# EAGLE design TDA2003-Amplifier-2 (EAGLE 7.2.0)
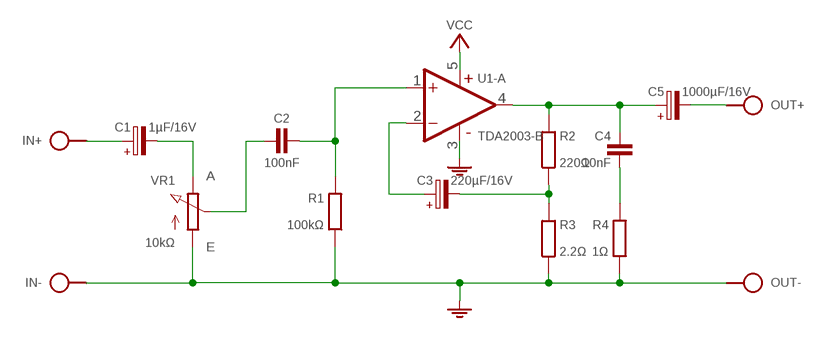
[diagram p0: schematic, sheet 1]

## Parts
C1  1µF/16V  CPOL-HE2,5-4  [E2,5-4]
C2  100nF  C-H050-020X044/V  [C050-020X044/V]
C3  220µF/16V  CPOL-HE5-5  [E5-5]
C4  10nF  C050-025X075/V  [C050-025X075/V]
C5  1000µF/16V  CPOL-HE5-5  [E5-5]
IN  SPAD+--+  [SPAD-+]
OUT  SPAD+-+-  [SPAD+-]
PWR  VCC_GNDL  [SPAD-+]
R1  100kΩ  R0204/10-V  [0204/10-V]
R2  220Ω  R0204/10-V  [0204/10-V]
R3  2.2Ω  R0204/10-V  [0204/10-V]
R4  1Ω  R0204/10-V  [0204/10-V]
U1  TDA2003-B  [TO220-B5]
VR1  10kΩ  POT-3P  [CONN-3P]

## Nets
AOUT: C4.1 C5.+ R2.1 U1.4(-A:OUT)
FB: C3.- R2.2 R3.1
GND: IN.1 OUT.1 PWR.1 R1.2 R3.2 R4.2 U1.3(-B:V-) VR1.1(A)
IN+: C2.2 R1.1 U1.1(-A:+IN)
IN-: C3.+ U1.2(-A:-IN)
N$1: C4.2 R4.1
N$2: C2.1 VR1.2(S)
N$3: C1.- VR1.3(E)
N$7: C1.+ IN.2
OUT: C5.- OUT.2
VCC: PWR.2 U1.5(-B:V+)

## Library data of the parts
C1 C3 C5 = c:CPOL-H
C2 = c:C-H
C4 = c:C: CAPACITOR, European symbol
IN OUT = pad:SPAD+-
PWR = pad:VCC_GND
R1-R4 = r:R: RESISTOR, European symbol
U1 = ic:TDA2003
VR1 = r:POT

## Board
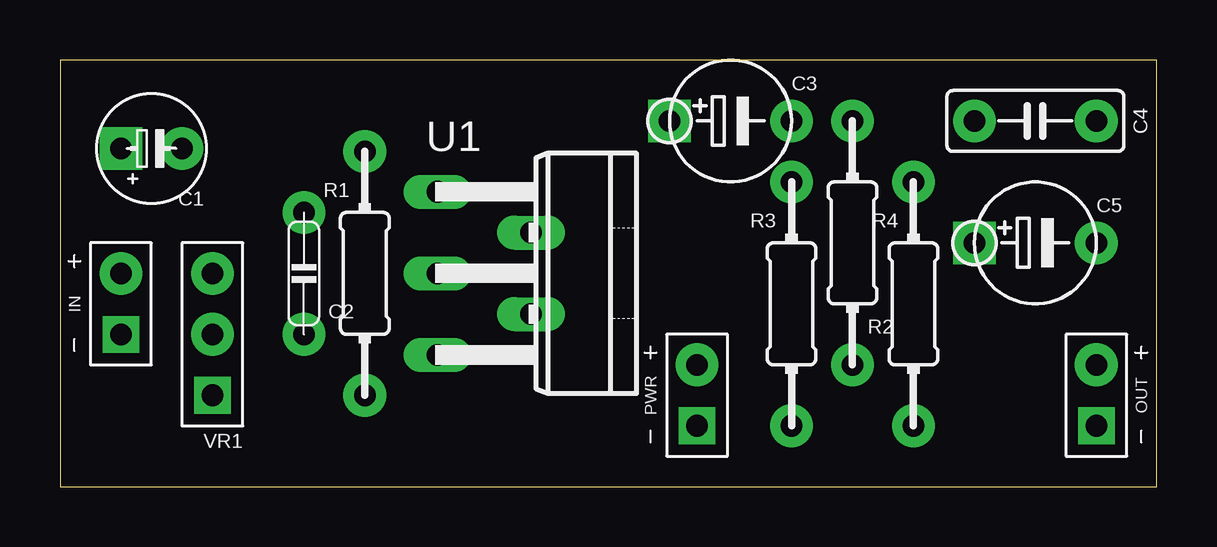
[diagram p1: board, top side]
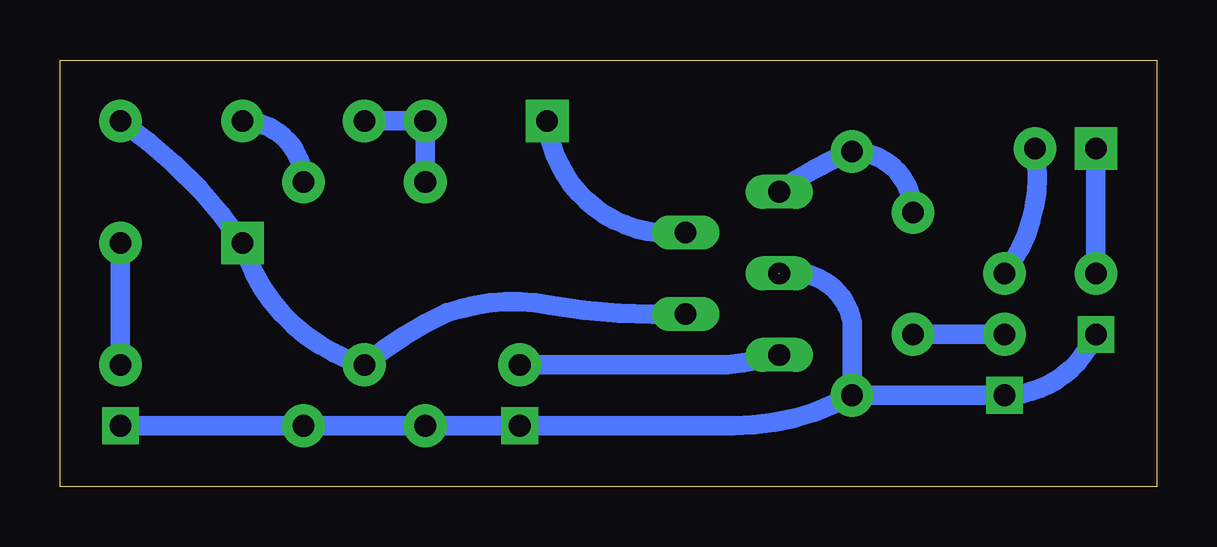
[diagram p2: board, bottom side, seen from below]

Size 45.7 x 17.78 mm. Coordinates in mm from the lower left corner, seen from the top.
Outline: 0,0 45.7,0 45.7,17.78 0,17.78 0,0
Copper layers (1*16): Top 0.035mm / dielectric 1.5mm / Bottom 0.035mm
Design rules "default": minimum track width 10mil, minimum drill 24mil, track to track 8mil, track to pad 8mil, pad to pad 8mil, via to via 8mil, smd to smd 8mil, copper to edge 40mil, drill to drill 8mil, minimum pad ring 10mil, minimum via ring 8mil, stop-mask expansion 4mil, vias tented up to drill 0mil, thermal gap 10mil

### Footprints (pad centres in the part's own frame; a part is rotated, then mirrored left to right if it is on the bottom)
E2,5-4 = drill 0.9 pad 1.778 square: + 1.27,0 | drill 0.9 pad 1.778: - -1.27,0
C050-020X044/V = drill 0.9 pad 1.778: 1 0,2.54; 2 0,-2.54
E5-5 = drill 0.9 pad 1.778 square: + -2.54,0 | drill 0.9 pad 1.778: - 2.54,0
C050-025X075/V = drill 0.9 pad 1.778: 1 0,2.54; 2 0,-2.54
SPAD-+ = drill 0.9 pad 1.524 square: 1 0,-1.27 | drill 0.9 pad 1.778: 2 0,1.27
SPAD+- = drill 0.9 pad 1.524 square: 1 0,-1.27 | drill 0.9 pad 1.778: 2 0,1.27
0204/10-V = drill 0.9 pad 1.778: 1 0,5.08; 2 0,-5.08
TO220-B5 = drill 0.9 long: 1 -3.4,-8.4; 2 -1.7,-4.5; 3 0,-8.4; 4 1.7,-4.5; 5 3.4,-8.4
CONN-3P = drill 0.9 pad 1.524 square: 1 0,2.54 | drill 0.9 pad 1.778: 2 0,0; 3 0,-2.54

### Placement (x,y rotation side)
C1  3.81,14.1 180 top
C2  10.16,8.89 180 top
C3  27.94,15.24 0 top
C4  40.64,15.24 270 top
C5  40.64,10.16 0 top
IN  2.54,7.62 0 top
OUT  43.18,3.81 0 top
PWR  26.54,3.81 0 top
R1  12.7,8.89 0 top
R2  33.02,10.16 180 top
R3  30.48,7.62 0 top
R4  35.56,7.62 0 top
U1  24.13,8.89 270 top
VR1  6.35,6.35 180 top

### Tracks (layer width: path | path; a pad name or v marks a point on that pad's centre or on a via)
AOUT
  Bottom 0.813: U1.4 19.56,7.24 arc15 25.27,7.57 arc-30 29.59,7.24 arc-15 R2.1 arc58 C5.+ arc-21 C4.1
FB
  Bottom 0.813: R2.2 C3.- R3.1
GND  (1 unrouted)
  Bottom 0.813: IN.1 2.54,6.48 arc70 VR1.1 R1.2 | R1.2 12.7,6.86 arc-90 15.62,8.89 15.75,8.89 | R1.2 arc29 17.65,2.54 PWR.1 R3.2 R4.2 OUT.1
IN+
  Bottom 0.813: U1.1 arc15 R1.1 arc90 C2.2
IN-
  Bottom 0.813: U1.2 19.66,10.58 19.81,10.58 arc90 C3.+ 25.4,15.3
N$1
  Bottom 0.813: C4.2 arc90 R4.1
N$2
  Bottom 0.813: VR1.2 C2.1
N$3
  Bottom 0.813: C1.- arc47 VR1.3
N$7
  Bottom 0.813: IN.2 C1.+
OUT
  Bottom 0.813: C5.- OUT.2
VCC
  Bottom 0.813: PWR.2 17.91,5.08 arc-10 15.88,5.46 arc-15 U1.5